# EAGLE design motor_driver (EAGLE 6.0)
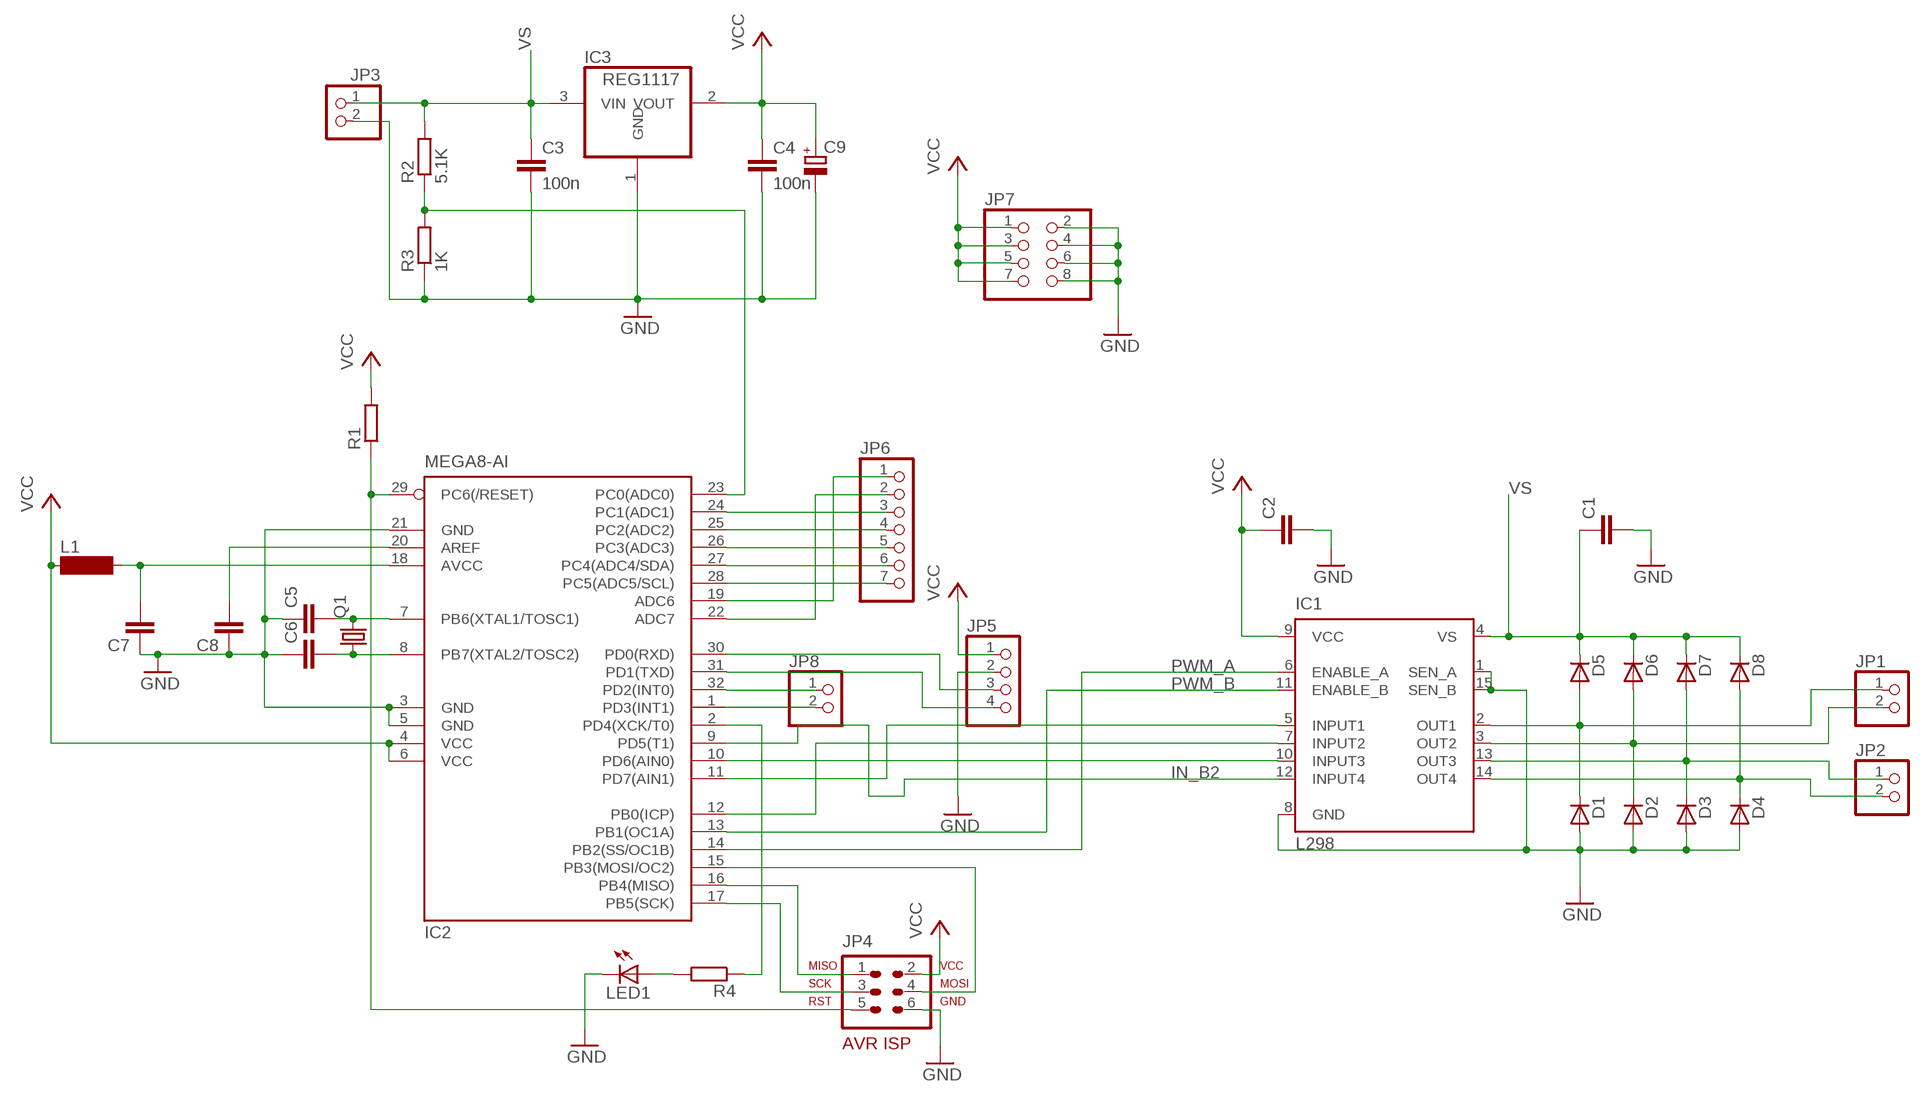
[diagram p0: schematic, sheet 1]

## Parts
C1  C-EUC0805  [C0805]
C2  C-EUC0805  [C0805]
C3  100n  C-EUC0805  [C0805]
C4  100n  C-EUC0805  [C0805]
C5  C-EUC0805  [C0805]
C6  C-EUC0805  [C0805]
C7  C-EUC0805  [C0805]
C8  C-EUC0805  [C0805]
C9  CPOL-EUE2,5-6E  [E2,5-6E]
D1  BYS10  [SOD106A]
D2  BYS10  [SOD106A]
D3  BYS10  [SOD106A]
D4  BYS10  [SOD106A]
D5  BYS10  [SOD106A]
D6  BYS10  [SOD106A]
D7  BYS10  [SOD106A]
D8  BYS10  [SOD106A]
IC1  L298  [MULTIWATT-15]
IC2  MEGA8-AI  [TQFP32-08]
IC3  REG1117  [SOT223]
JP1  PINHD-1X2  [1X02]
JP2  PINHD-1X2  [1X02]
JP3  PINHD-1X2  [1X02]
JP4  AVR-ISP-6VERT  [AVR-ISP-6]
JP5  PINHD-1X4  [1X04]
JP6  PINHD-1X7  [1X07]
JP7  PINHD-2X4  [2X04]
JP8  PINHD-1X2  [1X02]
L1  SM-1206  [SM-1206]
LED1  LED3MM  [LED3MM]
Q1  CRYSTALHC49S  [HC49/S]
R1  R-EU_M0805  [M0805]
R2  5.1K  R-EU_M0805  [M0805]
R3  1K  R-EU_M0805  [M0805]
R4  R-EU_M0805  [M0805]

## Nets
GND: C1.2 C2.2 C3.2 C4.2 C5.1 C6.1 C7.1 C8.1 C9.- D1.A D2.A D3.A D4.A IC1.1(SEN_A) IC1.8(GND) IC1.15(SEN_B) IC2.3(GND) IC2.5(GND) IC2.21(GND) IC3.1(GND) JP3.2 JP4.6 JP5.2 JP7.2 JP7.4 JP7.6 JP7.8 LED1.K(C) R3.1
IN_B2: IC1.12(INPUT4) IC2.9(PD5(T1))
N$1: D1.K D5.A IC1.2(OUT1) JP1.1
N$2: D2.K D6.A IC1.3(OUT2) JP1.2
N$3: D3.K D7.A IC1.13(OUT3) JP2.1
N$4: D4.K D8.A IC1.14(OUT4) JP2.2
N$5: IC2.16(PB4(MISO)) JP4.1
N$6: IC2.17(PB5(SCK)) JP4.3
N$7: IC2.15(PB3(MOSI/OC2)) JP4.4
N$9: C5.2 IC2.7(PB6(XTAL1/TOSC1)) Q1.2
N$10: IC2.23(PC0(ADC0)) R2.1 R3.2
N$11: IC2.29(PC6(/RESET)) JP4.5 R1.1
N$12: C6.2 IC2.8(PB7(XTAL2/TOSC2)) Q1.1
N$13: IC2.30(PD0(RXD)) JP5.3
N$14: C7.2 IC2.18(AVCC) L1.2
N$15: C8.2 IC2.20(AREF)
N$16: IC2.31(PD1(TXD)) JP5.4
N$17: IC2.28(PC5(ADC5/SCL)) JP6.7
N$18: IC2.27(PC4(ADC4/SDA)) JP6.6
N$19: IC2.26(PC3(ADC3)) JP6.5
N$20: IC2.25(PC2(ADC2)) JP6.4
N$21: IC2.24(PC1(ADC1)) JP6.3
N$22: IC2.19(ADC6) JP6.1
N$23: IC2.22(ADC7) JP6.2
N$24: IC2.2(PD4(XCK/T0)) R4.1
N$25: IC1.7(INPUT2) IC2.12(PB0(ICP))
N$26: IC1.5(INPUT1) IC2.11(PD7(AIN1))
N$29: IC1.10(INPUT3) IC2.10(PD6(AIN0))
N$30: LED1.A R4.2
N$36: IC2.32(PD2(INT0)) JP8.1
N$37: IC2.1(PD3(INT1)) JP8.2
PWM_A: IC1.11(ENABLE_B) IC2.13(PB1(OC1A))
PWM_B: IC1.6(ENABLE_A) IC2.14(PB2(SS/OC1B))
VCC: C2.1 C4.1 C9.+ IC1.9(VCC) IC2.4(VCC) IC2.6(VCC) IC3.2(VOUT) JP4.2 JP5.1 JP7.1 JP7.3 JP7.5 JP7.7 L1.1 R1.2
VS: C1.1 C3.1 D5.K D6.K D7.K D8.K IC1.4(VS) IC3.3(VIN) JP3.1 R2.2

## Library data of the parts
C1-C8 = rcl:C-EU: CAPACITOR, European symbol
C9 = resistor:CPOL-EU: POLARIZED CAPACITOR, European symbol
D1-D8 = telefunken:BYS10: DIODE; MPN: BYS10/45; OC_FARNELL: 9549188; OC_NEWARK: 96K7236
IC1 = st-microelectronics:L298: DUAL FULL-BRIDGE DRIVER; MPN: L298N; OC_FARNELL: 1589425; OC_NEWARK: 32M1527
IC2 = atmel:MEGA8: MICROCONTROLLER 8 Kbytes FLASH, 1 kbytes SRAM, 512 bytes EEPROM, USART, 6-channel 10 bit ADC, 2-channel 8 bit ADC Pin compatible with Atmega48, ATMega88, ATMega168 Source: avr.lbr; MPN: ATMEGA8-16AU; OC_FARNELL: 9171371; OC_NEWARK: 73M8863
IC3 = burr-brown:REG1117: 800mA and 1A Low Dropout (LDO) Positive Regulator 1.8V, 2.5V, 2.85V, 3.3V, 5V, and Adj; MPN: REG1117; OC_FARNELL: 1097566; OC_NEWARK: 14P6981
JP1-JP3 JP8 = pinhead:PINHD-1X2: PIN HEADER
JP4 = avr-7:AVR-ISP-6: AVR ISP-6 Serial Programming Header
JP5 = pinhead:PINHD-1X4: PIN HEADER
JP6 = pinhead:PINHD-1X7: PIN HEADER
JP7 = pinhead:PINHD-2X4: PIN HEADER
L1 = inductor-neosid:SM-1206: INDUCTOR SMD chip inductor; OC_FARNELL: unknown; OC_NEWARK: unknown
LED1 = led:LED: LED OSRAM: - CHIPLED LG R971, LG N971, LY N971, LG Q971, LY Q971, LO R971, LY R971 LH N974, LH R974 LS Q976, LO Q976, LY Q976 LO Q996 - Hyper CHIPLED LW Q18S LB Q993, LB Q99A, LB R99A - SideLED LS A670, LO A670, LY A670, LG A670, LP A670 LB A673, LV A673, LT A673, LW A673 LH A674 LY A675 LS A676, LA A676, LO A676, LY A676, LW A676 LS A679, LY A679, LG A679 - Hyper Micro SIDELED® LS Y876, LA Y876, LO Y876, LY Y876 LT Y87S - SmartLED LW L88C, LW L88S LB L89C, LB L89S, LG L890 LS L89K, LO L89K, LY L89K LS L896, LA L896, LO L896, LY L896 - TOPLED LS T670, LO T670, LY T670, LG T670, LP T670 LSG T670, LSP T670, LSY T670, LOP T670, LYG T670 LG T671, LOG T671, LSG T671 LB T673, LV T673, LT T673, LW T673 LH T674 LS T676, LA T676, LO T676, LY T676, LB T676, LH T676, LSB T676, LW T676 LB T67C, LV T67C, LT T67C, LS T67K, LO T67K, LY T67K, LW E67C LS E67B, LA E67B, LO E67B, LY E67B, LB E67C, LV E67C, LT E67C LW T67C LS T679, LY T679, LG T679 LS T770, LO T770, LY T770, LG T770, LP T770 LB T773, LV T773, LT T773, LW T773 LH T774 LS E675, LA E675, LY E675, LS T675 LS T776, LA T776, LO T776, LY T776, LB T776 LHGB T686 LT T68C, LB T68C - Hyper Mini TOPLED® LB M676 - Mini TOPLED Santana® LG M470 LS M47K, LO M47K, LY M47K Source: http://www.osram.convergy.de LUXEON: - LUMILED® LXK2-PW12-R00, LXK2-PW12-S00, LXK2-PW14-U00, LXK2-PW14-V00 LXK2-PM12-R00, LXK2-PM12-S00, LXK2-PM14-U00 LXK2-PE12-Q00, LXK2-PE12-R00, LXK2-PE12-S00, LXK2-PE14-T00, LXK2-PE14-U00 LXK2-PB12-K00, LXK2-PB12-L00, LXK2-PB12-M00, LXK2-PB14-N00, LXK2-PB14-P00, LXK2-PB14-Q00 LXK2-PR12-L00, LXK2-PR12-M00, LXK2-PR14-Q00, LXK2-PR14-R00 LXK2-PD12-Q00, LXK2-PD12-R00, LXK2-PD12-S00 LXK2-PH12-R00, LXK2-PH12-S00 LXK2-PL12-P00, LXK2-PL12-Q00, LXK2-PL12-R00 Source: www.luxeon.com KINGBRIGHT: KA-3528ASYC Source: www.kingbright.com
Q1 = crystal:CRYSTAL: CRYSTAL; OC_FARNELL: 1667008; OC_NEWARK: unknown
R1-R4 = rcl:R-EU_: RESISTOR, European symbol

## Board
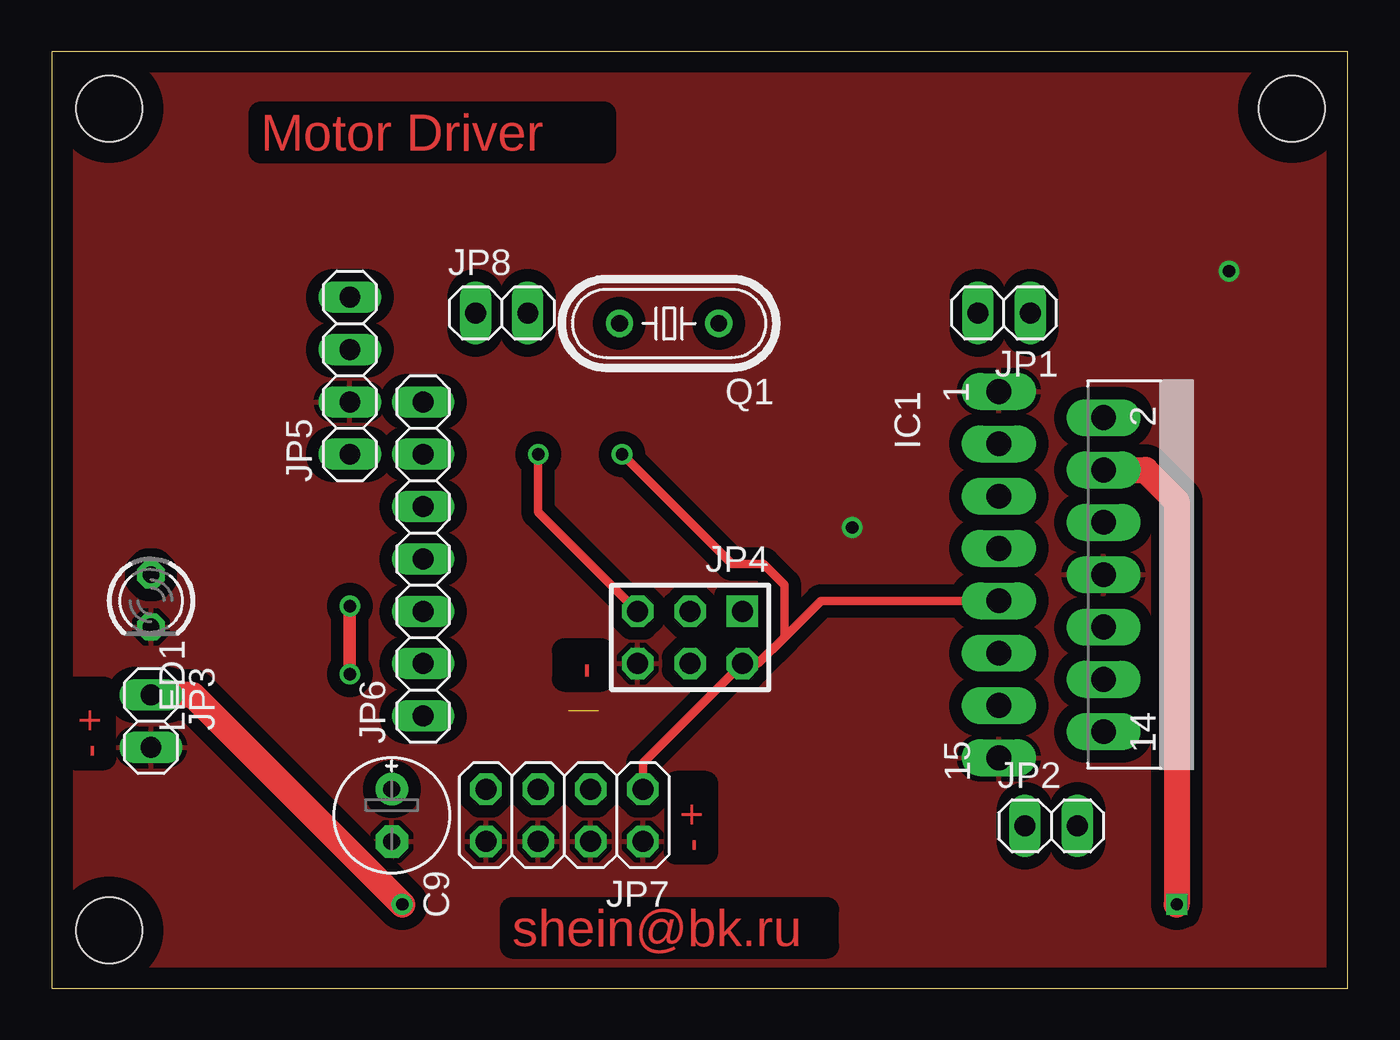
[diagram p1: board, top side]
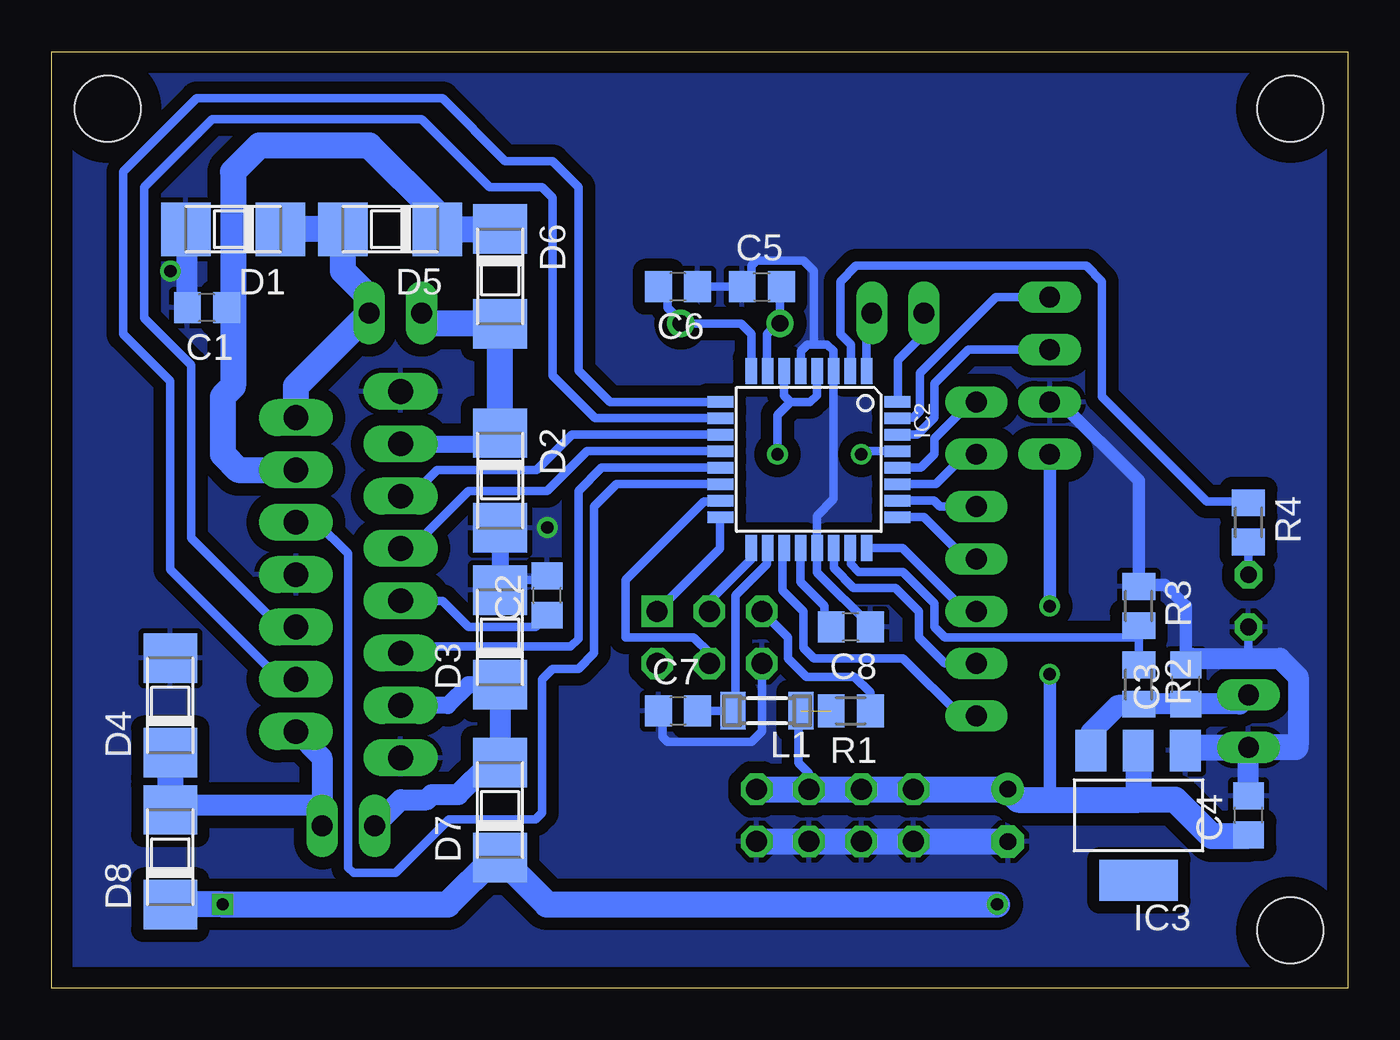
[diagram p2: board, bottom side, seen from below]

Size 62.92 x 45.46 mm. Coordinates in mm from the lower left corner, seen from the top.
Outline: 0,0 62.92,0 62.92,45.46 0,45.46 0,0
Copper layers (1*16): Top 0.035mm / dielectric 1.5mm / Bottom 0.035mm
Design rules: minimum track width 10mil, minimum drill 24mil, track to track 8mil, track to pad 8mil, pad to pad 8mil, via to via 8mil, smd to smd 8mil, copper to edge 40mil, drill to drill 8mil, minimum pad ring 10mil, minimum via ring 8mil, stop-mask expansion 4mil, vias tented up to drill 0mil, thermal gap 10mil
Holes 3.2 mm at 2.79,42.67 2.79,2.79 60.2,42.67

### Footprints (pad centres in the part's own frame; a part is rotated, then mirrored left to right if it is on the bottom)
C0805 = smd 1.3 x 1.5: 1 -0.95,0; 2 0.95,0
E2,5-6E = drill 0.813 pad 1.575: + -1.27,0 | drill 0.813 pad 1.575 octagon: - 1.27,0
SOD106A = smd 2.4 x 2.6: A 2.3,0; K -2.3,0
MULTIWATT-15 = drill 1.2 long: 1 -8.89,-7.62; 2 -7.62,-2.54; 3 -6.35,-7.62; 4 -5.08,-2.54; 5 -3.81,-7.62; 6 -2.54,-2.54; 7 -1.27,-7.62; 8 0,-2.54; 9 1.27,-7.62; 10 2.54,-2.54; 11 3.81,-7.62; 12 5.08,-2.54; 13 6.35,-7.62; 14 7.62,-2.54; 15 8.89,-7.62
TQFP32-08 = smd 1.27 x 0.559: 1 -4.293,2.8; 2 -4.293,2; 3 -4.293,1.2; 4 -4.293,0.4; 5 -4.293,-0.4; 6 -4.293,-1.2; 7 -4.293,-2; 8 -4.293,-2.8; 17 4.293,-2.8; 18 4.293,-2; 19 4.293,-1.2; 20 4.293,-0.4; 21 4.293,0.4; 22 4.293,1.2; 23 4.293,2; 24 4.293,2.8 | smd 0.559 x 1.27: 9 -2.8,-4.293; 10 -2,-4.293; 11 -1.2,-4.293; 12 -0.4,-4.293; 13 0.4,-4.293; 14 1.2,-4.293; 15 2,-4.293; 16 2.8,-4.293; 25 2.8,4.293; 26 2,4.293; 27 1.2,4.293; 28 0.4,4.293; 29 -0.4,4.293; 30 -1.2,4.293; 31 -2,4.293; 32 -2.8,4.293
SOT223 = smd 1.499 x 2.007: 1 -2.261,-3.15; 2 0.025,-3.15; 3 2.311,-3.15 | smd 3.81 x 2.007: 4 0,3.15
1X02 = drill 1.016 long: 1 -1.27,0; 2 1.27,0
AVR-ISP-6 = drill 1.016 square: 1 -2.54,-1.27 | drill 1.016 octagon: 2 -2.54,1.27; 3 0,-1.27; 4 0,1.27; 5 2.54,-1.27; 6 2.54,1.27
1X04 = drill 1.016 long: 1 -3.81,0; 2 -1.27,0; 3 1.27,0; 4 3.81,0
1X07 = drill 1.016 long: 1 -7.62,0; 2 -5.08,0; 3 -2.54,0; 4 0,0; 5 2.54,0; 6 5.08,0; 7 7.62,0
2X04 = drill 1.016 octagon: 1 -3.81,-1.27; 2 -3.81,1.27; 3 -1.27,-1.27; 4 -1.27,1.27; 5 1.27,-1.27; 6 1.27,1.27; 7 3.81,-1.27; 8 3.81,1.27
SM-1206 = smd 1.2 x 1.8: 1 -1.65,0; 2 1.65,0
LED3MM = drill 0.813 octagon: A -1.27,0; K 1.27,0
HC49/S = drill 0.813: 1 -2.413,0; 2 2.413,0
M0805 = smd 1.3 x 1.6: 1 -0.95,0; 2 0.95,0

### Placement (x,y rotation side)
C1  55.37,33.02 180 bottom
C2  38.86,19.05 90 bottom
C3  7.87,14.73 90 bottom
C4  4.83,8.38 90 bottom
C5  28.45,34.04 0 bottom
C6  32.51,34.04 180 bottom
C7  32.51,13.46 0 bottom
C8  24.13,17.53 180 bottom
C9  16.51,8.38 270 top
D1  54.1,36.83 180 bottom
D2  41.15,24.64 270 bottom
D3  41.15,17.02 90 bottom
D4  57.15,13.72 90 bottom
D5  46.48,36.83 180 bottom
D6  41.15,34.54 270 bottom
D7  41.15,8.64 90 bottom
D8  57.15,6.35 90 bottom
IC1  53.59,20.07 270 top
IC2  26.16,25.65 270 bottom
IC3  10.16,8.38 180 bottom
JP1  46.23,32.77 180 top
JP2  48.51,7.87 0 top
JP3  4.83,12.95 270 top
JP4  30.99,17.02 180 top
JP5  14.48,29.72 90 top
JP6  18.03,20.83 90 top
JP7  24.89,8.38 180 top
JP8  21.84,32.77 0 top
L1  28.19,13.46 180 bottom
LED1  4.83,18.8 270 top
Q1  29.97,32.26 180 top
R1  24.13,13.46 180 bottom
R2  10.16,14.73 270 bottom
R3  10.16,18.54 270 bottom
R4  4.83,22.61 270 bottom

### Tracks (layer width: path | path; a pad name or v marks a point on that pad's centre or on a via)
GND  (via drill 0.6)
  Bottom 0.406: C6.1 C5.1 28.96,34.48 28.96,35.05 28.7,35.31 26.42,35.31 25.91,34.8 25.91,31.24 | IC2.5 26.54,29.97 26.54,30.92 26.23,31.24 25.91,31.24 | 25.91,31.24 25.27,31.24 24.96,30.93 IC2.3 24.96,23.74 25.78,22.92 25.78,21.38 IC2.21 25.76,20.17 23.18,17.59 C8.1 | C2.2 39.05,19.81 40.13,19.81 40.64,19.3 41.15,19.3 | C7.1 33.27,13.27 33.27,12.19 33.02,11.94 28.96,11.94 28.45,12.45 JP4.6 | LED1.K 4.83,16
  Bottom 0.61: JP5.2 13.97,28.45 10.16,24.64 R3.1 10.09,19.56 8.89,19.56 7.87,18.54 C3.2
  Bottom 0.813: D2.A D3.A
  Bottom 1.016: C1.2 56.32,36.75 D1.A | C4.2 JP3.2 | 2.54,11.68 2.41,11.81 2.41,15.11 3.3,16 4.83,16 7.55,16 C3.2
  Bottom 1.27: IC3.1 7.75,11.68 JP3.2 2.54,11.68 | JP7.2 JP7.4 JP7.6 JP7.8 C9.-
  other vias: 57.15,34.8 38.86,22.35
  pour Top (isolate 0.61): 0,0 0,45.47 62.99,45.47 62.99,0
  pour Bottom (isolate 0.61): 0,0 0,45.47 62.99,45.47 62.99,45.21 62.99,0
IN_B2
  Bottom 0.406: IC1.12 51.82,14.99 57.15,20.32 57.15,29.46 59.44,31.75 59.44,39.62 55.88,43.18 43.94,43.18 40.89,40.13 38.61,40.13 37.34,38.86 37.34,29.97 35.82,28.45 IC2.9
N$1
  Bottom 1.27: D1.K D5.A 48.77,36.82 48.77,34.8 47.5,33.53 JP1.1 51.05,29.21 IC1.2
N$2
  Bottom 0.813: 41.15,26.67 D2.K 41.67,26.42 IC1.3
  Bottom 1.27: JP1.2 44.44,32.24 D6.A D2.K
N$3
  Bottom 0.813: 41.15,14.73 D3.K 42.69,14.72 43.69,13.72 IC1.13
  Bottom 1.016: D3.K D7.A 41.64,10.94 43.18,9.4 44.45,9.4 44.7,9.14 45.97,9.14 JP2.1
N$4
  Bottom 1.016: IC1.14 49.78,11.18 49.78,8.89 | 49.78,8.89 JP2.2 | D8.A 56.91,8.89 49.78,8.89
  Bottom 1.27: D4.K D8.A
N$5
  Bottom 0.406: JP4.1 30.48,21.34 30.48,22.83 IC2.16
N$6
  Bottom 0.406: IC2.17 28.96,20.83 30.99,18.8 JP4.3
N$7
  Bottom 0.406: JP4.4 30.99,16.26 31.75,17.02 35.05,17.02 35.05,19.81 31.24,23.62 30.49,23.62 IC2.15
N$9
  Bottom 0.406: C5.2 27.56,33.98 Q1.2 27.69,32.26 28.19,31.75 28.19,29.98 IC2.7
N$10
  Bottom 0.406: IC2.23 24.13,21.33 24.13,20.57 23.75,20.19 21.59,20.19 20.07,18.67 20.07,17.53 19.56,17.02 10.16,17.02 | R2.1 10.16,17.02 | 10.16,17.02 R3.2
N$11  (via drill 0.6)
  Top 0.406: JP4.5 23.62,23.11 v23.62,25.91
  Bottom 0.406: v23.62,25.91 23.48,26.05 IC2.29 | JP4.5 27.18,17.02 27.18,16 26.29,15.11 23.94,15.11 23.18,14.35 R1.1
N$12
  Bottom 0.406: C6.2 33.02,33.59 33.02,33.02 32.38,32.38 Q1.1 29.46,32.26 28.96,31.75 IC2.8
N$13
  Bottom 0.406: IC2.30 20.89,26.86 20.07,27.69 20.07,29.34 18.41,30.99 JP5.3
N$14
  Bottom 0.406: IC2.18 28.19,21.33 28.19,20.57 29.72,19.05 29.72,13.59 L1.2 C7.2
N$15
  Bottom 0.406: C8.2 25.4,17.85 25.4,18.54 26.56,19.7 IC2.20
N$16
  Bottom 0.406: IC2.31 21.84,27.69 21.08,27.69 20.77,28 20.77,29.84 17.08,33.53 JP5.4
N$17
  Bottom 0.406: IC2.28 20.72,25.25 20.07,25.91 20.07,26.67 18.54,28.19 18.29,28.19 JP6.7
N$18
  Bottom 0.406: IC2.27 20,24.45 18.54,25.91 JP6.6
N$19
  Bottom 0.406: IC2.26 20.1,23.65 19.81,23.37 JP6.5
N$20
  Bottom 0.406: IC2.25 20.57,22.85 18.54,20.83 JP6.4
N$21
  Bottom 0.406: IC2.24 21.61,21.36 18.54,18.29 JP6.3
N$22
  Bottom 0.406: IC2.19 27.43,21.29 27.43,19.3 26.42,18.29 26.42,16.51 25.91,16 21.59,16 18.8,13.21 JP6.1
N$23
  Bottom 0.406: IC2.22 24.96,20.38 24,19.43 21.97,19.43 20.83,18.29 20.83,17.02 19.56,15.75 JP6.2
N$24
  Bottom 0.406: IC2.2 24.13,29.98 24.13,31.24 24.64,31.75 24.64,34.29 23.88,35.05 12.7,35.05 11.94,34.29 11.94,28.7 6.86,23.62 4.83,23.62 R4.1
N$25
  Bottom 0.406: IC1.7 45.47,21.34 42.67,24.13 38.86,24.13 36.94,26.05 IC2.12
N$26
  Bottom 0.406: IC1.5 45.47,23.88 44.2,25.15 39.37,25.15 37.66,26.85 IC2.11
N$29
  Bottom 0.406: IC1.10 51.82,17.53 56.13,21.84 56.13,30.23 58.42,32.51 58.42,38.86 55.12,42.16 44.96,42.16 41.66,38.86 39.12,38.86 38.61,38.35 38.61,29.72 36.54,27.65 IC2.10
N$30
  Bottom 0.406: LED1.A R4.2
N$36
  Bottom 0.406: JP8.1 20.57,31.75 21.84,30.48 21.84,28.48 IC2.32
N$37
  Bottom 0.406: IC2.1 23.36,32.52 JP8.2
PWM_A
  Bottom 0.406: IC2.13 36.21,25.25 37.34,24.13 37.34,16.95 37.72,16.57 45.66,16.57 IC1.11
PWM_B
  Bottom 0.406: IC1.6 50.04,22.61 48.51,21.08 48.51,5.84 48.26,5.59 46.23,5.59 43.62,8.19 39.43,8.19 39.12,8.51 39.12,14.99 38.61,15.49 37.34,15.49 36.58,16.26 36.58,23.37 35.49,24.45 IC2.14
VCC  (via drill 0.6)  (1 unrouted)
  Top 0.406: v27.69,25.91 33.02,20.57 34.54,20.57 35.56,19.56 35.56,17.02 | 35.56,17.02 34.29,15.75 JP4.2 28.7,10.92 JP7.1 | 35.56,17.02 37.34,18.8 IC1.9
  Top 0.61: v14.48,18.54 v14.48,15.24
  Bottom 0.406: IC2.4 25.78,29.93 25.78,28.77 26.1,28.45 27.05,28.45 | 27.05,28.45 27.36,28.76 IC2.6 | C2.1 39.44,17.53 42.67,17.53 43.94,18.8 IC1.9 | L1.1 26.67,13.34 26.67,10.92 26.16,10.41 JP7.3 | 10.16,11.43 10.19,11.46 IC3.2 | 27.05,28.45 27.69,27.81 v27.69,25.91
  Bottom 0.61: JP5.1 v14.48,18.54 | v14.48,15.24 14.48,9.14
  Bottom 1.27: JP7.1 JP7.3 JP7.5 JP7.7 C9.+ 16,9.14 14.48,9.14 10.16,9.14 | 10.16,9.14 10.16,11.43 | C4.1 4.89,7.37 6.6,7.37 8.38,9.14 10.16,9.14
VS  (via drill 0.6)
  Top 1.27: IC1.4 53.09,25.15 54.61,23.62 v54.61,4.06 | v17.02,4.06 6.86,14.22 JP3.1
  Bottom 0.406: C1.1 54.42,29.53 54.1,29.21
  Bottom 1.016: JP3.1 5.27,13.78 C3.1 R2.2 10.23,13.72 11.18,13.72 12.47,12.42 IC3.3
  Bottom 1.27: D6.K 41.16,36.83 D5.K 44.18,37.58 47.5,40.89 52.83,40.89 54.1,39.62 54.1,29.21 54.61,28.7 54.61,25.91 53.85,25.15 IC1.4 | D8.K 57.14,4.06 v54.61,4.06 43.69,4.06 41.4,6.35 D7.K 38.88,4.06 v17.02,4.06

### Text on the board
Top: Motor Driver | - | - + | - + | shein@bk.ru